# Altium schematic sheet ETH_PCIE_PHY.SchDoc: =project_title
size Tabloid; CompanyName: Luxonis Holding; Organization: Luxonis Holding; Address1: 1925 Harmony Park Drive; Address2: Westminster, CO; Address3: 80234; Address4: United States; SheetNumber: 7; SheetTotal: 12
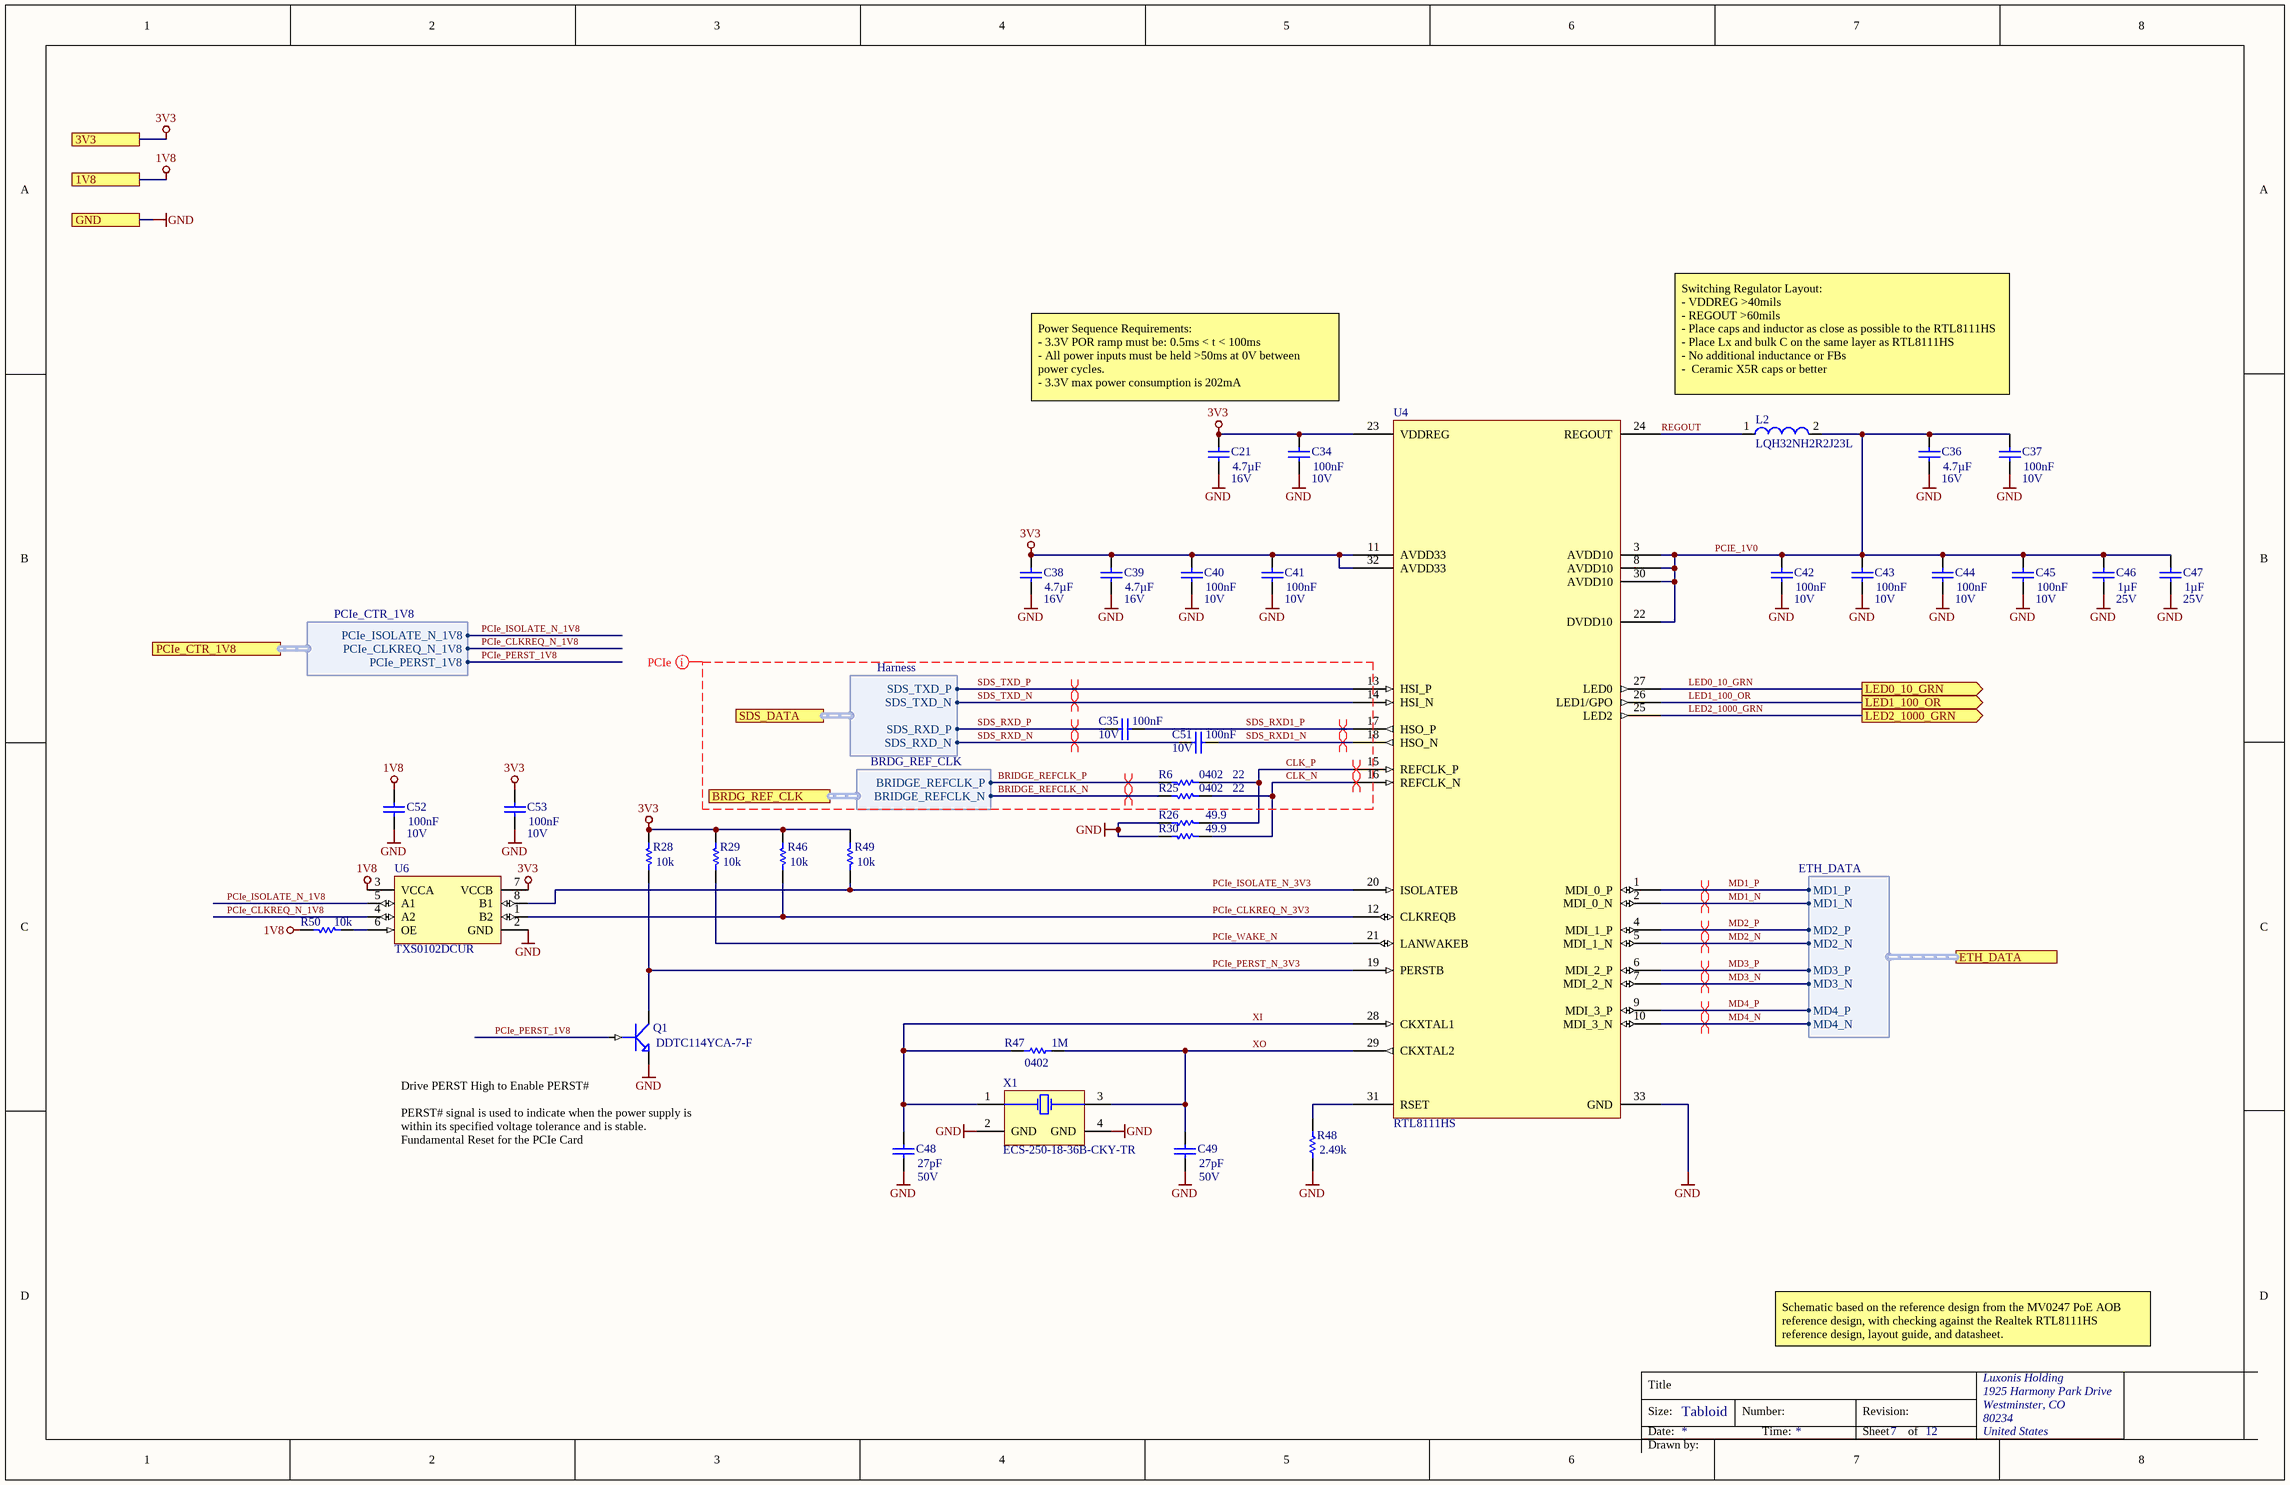
[diagram p0: ETH_PCIE_PHY.SchDoc]

## Parts
C21  value 4.7µF  Voltage Rating: 16V  [CAPC0603(1608)100_N]  (hidden comment: GRM188R61C475KAAJD)
C34  value 100nF  Voltage Rating: 10V  [CAPC0402(1005)70_N]  (hidden comment: GRM155R71A104JA01D)
C35  value 100nF  Voltage Rating: 10V  [CAPC0201(0603)33_L]  (hidden comment: GRM033R61A104KE15D)
C36  value 4.7µF  Voltage Rating: 16V  [CAPC0603(1608)100_N]  (hidden comment: GRM188R61C475KAAJD)
C37  value 100nF  Voltage Rating: 10V  [CAPC0402(1005)70_N]  (hidden comment: GRM155R71A104JA01D)
C38  value 4.7µF  Voltage Rating: 16V  [CAPC0603(1608)100_N]  (hidden comment: GRM188R61C475KAAJD)
C39  value 4.7µF  Voltage Rating: 16V  [CAPC0603(1608)100_N]  (hidden comment: GRM188R61C475KAAJD)
C40  value 100nF  Voltage Rating: 10V  [CAPC0402(1005)70_N]  (hidden comment: GRM155R71A104JA01D)
C41  value 100nF  Voltage Rating: 10V  [CAPC0402(1005)70_N]  (hidden comment: GRM155R71A104JA01D)
C42  value 100nF  Voltage Rating: 10V  [CAPC0402(1005)70_N]  (hidden comment: GRM155R71A104JA01D)
C43  value 100nF  Voltage Rating: 10V  [CAPC0402(1005)70_N]  (hidden comment: GRM155R71A104JA01D)
C44  value 100nF  Voltage Rating: 10V  [CAPC0402(1005)70_N]  (hidden comment: GRM155R71A104JA01D)
C45  value 100nF  Voltage Rating: 10V  [CAPC0402(1005)70_N]  (hidden comment: GRM155R71A104JA01D)
C46  value 1µF  Voltage Rating: 25V  [CAPC0402(1005)70_N]  (hidden comment: GRM155R61E105KA12D)
C47  value 1µF  Voltage Rating: 25V  [CAPC0402(1005)70_N]  (hidden comment: GRM155R61E105KA12D)
C48  value 27pF  Voltage Rating: 50V  [CAPC0402(1005)60_N]  (hidden comment: C0402C270J5GACTU)
C49  value 27pF  Voltage Rating: 50V  [CAPC0402(1005)60_N]  (hidden comment: C0402C270J5GACTU)
C51  value 100nF  Voltage Rating: 10V  [CAPC0201(0603)33_L]  (hidden comment: GRM033R61A104KE15D)
C52  value 100nF  Voltage Rating: 10V  [CAPC0402(1005)70_N]  (hidden comment: GRM155R71A104JA01D)
C53  value 100nF  Voltage Rating: 10V  [CAPC0402(1005)70_N]  (hidden comment: GRM155R71A104JA01D)
L2  LQH32NH2R2J23L  [LQH32NH2R2J23L]
Q1  DDTC114YCA-7-F  [DDTC114YCA-7-F-Footprint-1]
R6  value 22  Case/Package: 0402  [RESC0402(1005)_L]  (hidden comment: RC0402FR-0722RL)
R25  value 22  Case/Package: 0402  [RESC0402(1005)_L]  (hidden comment: RC0402FR-0722RL)
R26  value 49.9  [RESC0402(1005)_L]  (hidden comment: RC0402FR-0749R9L)
R28  value 10k  [RESC0402(1005)_N]  (hidden comment: RC0402FR-1310KL)
R29  value 10k  [RESC0402(1005)_N]  (hidden comment: RC0402FR-1310KL)
R30  value 49.9  [RESC0402(1005)_L]  (hidden comment: RC0402FR-0749R9L)
R46  value 10k  [RESC0402(1005)_N]  (hidden comment: RC0402FR-1310KL)
R47  value 1M  Case/Package: 0402  [RESC0402(1005)_N]  (hidden comment: RC0402FR-071ML)
R48  value 2.49k  [RESC0402(1005)_N]  (hidden comment: RC0402FR-072K49L)
R49  value 10k  [RESC0402(1005)_N]  (hidden comment: RC0402FR-1310KL)
R50  value 10k  [RESC0402(1005)_N]  (hidden comment: RC0402FR-1310KL)
U4  RTL8111HS  [RTL8111Hx-CG]
U6  TXS0102DCUR  [TXS0102DCUR]
X1  ECS-250-18-36B-CKY-TR  [ECS-250-18-36B-CKY-TR]

## Ports
1V8, 3V3, BRDG_REF_CLK (harness BRDG_REF_CLK), ETH_DATA (harness ETH_DATA), GND, LED0_10_GRN (out), LED1_100_OR (out), LED2_1000_GRN (out), PCIe_CTR_1V8 (harness PCIe_CTR_1V8), SDS_DATA (harness Harness)

## Harnesses
ETH_DATA: MD1_P, MD1_N, MD2_P, MD2_N, MD3_P, MD3_N, MD4_P, MD4_N
Harness: SDS_TXD_P, SDS_TXD_N, SDS_RXD_P, SDS_RXD_N
BRDG_REF_CLK: BRIDGE_REFCLK_P, BRIDGE_REFCLK_N
PCIe_CTR_1V8: PCIe_CLKREQ_N_1V8, PCIe_ISOLATE_N_1V8, PCIe_PERST_1V8

## Nets
1V8: C52.2 R50.2 U6.3(VCCA) ; port 1V8
3V3: C21.2 C34.2 C38.2 C39.2 C40.2 C41.2 C53.2 R28.1 R29.1 R46.1 R49.1 U4.11(AVDD33) U4.23(VDDREG) U4.32(AVDD33) U6.7(VCCB) ; port 3V3
GND: C21.1 C34.1 C36.1 C37.1 C38.1 C39.1 C40.1 C41.1 C42.1 C43.1 C44.1 C45.1 C46.1 C47.1 C48.1 C49.1 C52.1 C53.1 Q1.2(E) R26.1 R30.1 R48.1 U4.33(GND) U6.2(GND) X1.2(GND) X1.4(GND) ; port GND
BRIDGE_REFCLK_N: R25.2 ; port BRDG_REF_CLK.BRIDGE_REFCLK_N
BRIDGE_REFCLK_P: R6.2 ; port BRDG_REF_CLK.BRIDGE_REFCLK_P
CLK_N: R25.1 R30.2 U4.16(REFCLK_N)
CLK_P: R6.1 R26.2 U4.15(REFCLK_P)
LED0_10_GRN: U4.27(LED0) ; port LED0_10_GRN
LED1_100_OR: U4.26(LED1/GPO) ; port LED1_100_OR
LED2_1000_GRN: U4.25(LED2) ; port LED2_1000_GRN
MD1_N: U4.2(MDI_0_N) ; port ETH_DATA.MD1_N
MD1_P: U4.1(MDI_0_P) ; port ETH_DATA.MD1_P
MD2_N: U4.5(MDI_1_N) ; port ETH_DATA.MD2_N
MD2_P: U4.4(MDI_1_P) ; port ETH_DATA.MD2_P
MD3_N: U4.7(MDI_2_N) ; port ETH_DATA.MD3_N
MD3_P: U4.6(MDI_2_P) ; port ETH_DATA.MD3_P
MD4_N: U4.10(MDI_3_N) ; port ETH_DATA.MD4_N
MD4_P: U4.9(MDI_3_P) ; port ETH_DATA.MD4_P
PCIE_1V0: C36.2 C37.2 C42.2 C43.2 C44.2 C45.2 C46.2 C47.2 L2.2 U4.3(AVDD10) U4.8(AVDD10) U4.22(DVDD10) U4.30(AVDD10)
PCIe_CLKREQ_N_1V8: U6.4(A2) ; port PCIe_CTR_1V8.PCIe_CLKREQ_N_1V8
PCIe_CLKREQ_N_3V3: R46.2 U4.12(CLKREQB) U6.1(B2)
PCIe_ISOLATE_N_1V8: U6.5(A1) ; port PCIe_CTR_1V8.PCIe_ISOLATE_N_1V8
PCIe_ISOLATE_N_3V3: R49.2 U4.20(ISOLATEB) U6.8(B1)
PCIe_PERST_1V8: Q1.1(B) ; port PCIe_CTR_1V8.PCIe_PERST_1V8
PCIe_PERST_N_3V3: Q1.3(C) R28.2 U4.19(PERSTB)
PCIe_WAKE_N: R29.2 U4.21(LANWAKEB)
REGOUT: L2.1 U4.24(REGOUT)
SDS_RXD1_N: C51.2 U4.18(HSO_N)
SDS_RXD1_P: C35.2 U4.17(HSO_P)
SDS_RXD_N: C51.1 ; port SDS_DATA.SDS_RXD_N
SDS_RXD_P: C35.1 ; port SDS_DATA.SDS_RXD_P
SDS_TXD_N: U4.14(HSI_N) ; port SDS_DATA.SDS_TXD_N
SDS_TXD_P: U4.13(HSI_P) ; port SDS_DATA.SDS_TXD_P
XI: C48.2 R47.1 U4.28(CKXTAL1) X1.1(X1)
XO: C49.2 R47.2 U4.29(CKXTAL2) X1.3(X2)
NetR48_2: R48.2 U4.31(RSET)
NetR50_1: R50.1 U6.6(OE)

## Layout directives
differential pair; net class ETH; differential pair class 100ohm: MD1_N, MD1_P, MD2_N, MD2_P, MD3_N, MD3_P, MD4_N, MD4_P
differential pair; differential pair class 100ohm: BRIDGE_REFCLK_N, BRIDGE_REFCLK_P, CLK_N, CLK_P, SDS_RXD1_N, SDS_RXD1_P, SDS_RXD_N, SDS_RXD_P, SDS_TXD_N, SDS_TXD_P
net class PCIe: BRIDGE_REFCLK_N, BRIDGE_REFCLK_P, CLK_N, CLK_P, SDS_RXD1_N, SDS_RXD1_P, SDS_RXD_N, SDS_RXD_P, SDS_TXD_N, SDS_TXD_P

## Notes on the sheet
- Power Sequence Requirements:
  - 3.3V POR ramp must be: 0.5ms < t < 100ms
  - All power inputs must be held >50ms at 0V between power cycles.
  - 3.3V max power consumption is 202mA
- Switching Regulator Layout:
  - VDDREG >40mils
  - REGOUT >60mils
  - Place caps and inductor as close as possible to the RTL8111HS
  - Place Lx and bulk C on the same layer as RTL8111HS
  - No additional inductance or FBs
  -  Ceramic X5R caps or better
- (near Q1) Drive PERST High to Enable PERST#
- PERST# signal is used to indicate when the power supply is within its specified voltage tolerance and is stable.
  Fundamental Reset for the PCIe Card
- Schematic based on the reference design from the MV0247 PoE AOB reference design, with checking against the Realtek RTL8111HS reference design, layout guide, and datasheet.
- Title
- Size:
- Date:
- Tabloid
- Number:
- Time:
- Revision:
- Sheet
- of
- Drawn by:

## Library data of the parts
C21 C36 C38 C39 = CMP-004-000020-4: CAP CER 4.7UF 16V X5R 0603 10%; Manufacturer 1: Murata; Manufacturer Part Number 1: GRM188R61C475KAAJD; Case/Package: 0603; Min Operating Temperature: -55°C; Max Operating Temperature: 85°C; Tolerance: 10%; Dielectric: X5R; Length: 1.6mm; Height: 0.8mm; Width: 0.8mm; Depth: 0.8mm; ComponentLink1URL: https://datasheet.ciiva.com/14813/595grm188r61c475kaaj23-14813668.pdf?src-supplier=Arrow; ComponentLink1Description: https://datasheet.ciiva.com/14813/595grm188r61c475kaaj23-14813668.pdf?src-supplier=Arrow; Manufacturer 2: Murata; Manufacturer Part Number 2: GRM188R61C475KAAJD; Manufacturer 3: Murata; Manufacturer Part Number 3: GRM188R61C475KAAJD; Design Item ID: GRM188R61C475KAAJD; Mounting Technology: SMT
C34 C37 C40-C45 C52 C53 = CMP-108-000015-5: CAP CER 0.1UF 10V X7R 0402 5%; Manufacturer 1: Murata; Manufacturer Part Number 1: GRM155R71A104JA01D; Case/Package: 0402; Min Operating Temperature: -55°C; Max Operating Temperature: 125°C; Tolerance: 5%; Dielectric: X7R; Length: 1mm; Height: 0.5mm; Width: 0.02inch; Depth: 0.5mm; ComponentLink1URL: https://datasheet.ciiva.com/5411/product-5411135.pdf?src-supplier=Mouser; ComponentLink1Description: https://datasheet.ciiva.com/5411/product-5411135.pdf?src-supplier=Mouser; ComponentLink2URL: https://datasheet.ciiva.com/11618/c02e-11618821.pdf?src-supplier=Avnet; ComponentLink2Description: https://datasheet.ciiva.com/11618/c02e-11618821.pdf?src-supplier=Avnet; Design Item ID: GRM155R71A104JA01D; Mounting Technology: SMT
C35 C51 = CMP-004-000007-6: CAP CER 0.1UF 10V X5R 0201 10%; Manufacturer 1: Murata; Manufacturer Part Number 1: GRM033R61A104KE15D; Case/Package: 0201; Min Operating Temperature: -55°C; Max Operating Temperature: 85°C; Tolerance: 10%; Dielectric: X5R; Length: 0.6mm; Height: 0.3mm; Width: 0.012inch; Depth: 0.3mm; ComponentLink1URL: https://datasheet.ciiva.com/26843/getdatasheetpartid-308656-26843739.pdf?src-supplier=Verical; ComponentLink1Description: https://datasheet.ciiva.com/26843/getdatasheetpartid-308656-26843739.pdf?src-supplier=Verical; ComponentLink2URL: https://datasheet.ciiva.com/5413/product-5413117.pdf?src-supplier=Mouser; ComponentLink2Description: https://datasheet.ciiva.com/5413/product-5413117.pdf?src-supplier=Mouser; ComponentLink3URL: https://datasheet.ciiva.com/6256/partnumbering-e-01-6256406.pdf?src-supplier=Digi-Key; ComponentLink3Description: https://datasheet.ciiva.com/6256/partnumbering-e-01-6256406.pdf?src-supplier=Digi-Key; ComponentLink4URL: https://datasheet.ciiva.com/6256/partnumbering-e-01-6256407.pdf?src-supplier=Digi-Key; ComponentLink4Description: https://datasheet.ciiva.com/6256/partnumbering-e-01-6256407.pdf?src-supplier=Digi-Key; ComponentLink5URL: https://datasheet.ciiva.com/6256/partnumbering-e-01-6256408.pdf?src-supplier=Digi-Key; ComponentLink5Description: https://datasheet.ciiva.com/6256/partnumbering-e-01-6256408.pdf?src-supplier=Digi-Key; Design Item ID: GRM033R61A104KE15D; Mounting Technology: SMT
C46 C47 = CMP-108-000014-5: CAP CER 1UF 25V X5R 0402 10%; Manufacturer 1: Murata; Manufacturer Part Number 1: GRM155R61E105KA12D; Case/Package: 0402; Min Operating Temperature: -55°C; Max Operating Temperature: 85°C; Tolerance: 10%; Dielectric: X5R; Length: 1mm; Height: 0.5mm; Width: 0.5mm; Depth: 0.5mm; ComponentLink1URL: https://datasheet.ciiva.com/22732/1666664-22732122.pdf?src-supplier=Element14; ComponentLink1Description: https://datasheet.ciiva.com/22732/1666664-22732122.pdf?src-supplier=Element14; ComponentLink2URL: https://datasheet.ciiva.com/7719/1666664-7719006.pdf?src-supplier=Element14; ComponentLink2Description: https://datasheet.ciiva.com/7719/1666664-7719006.pdf?src-supplier=Element14; Design Item ID: GRM155R61E105KA12D; Mounting Technology: SMT
C48 C49 = CMP-108-000006-6: CAP CER 27PF 50V C0G 0402 5%; Manufacturer 1: KEMET; Manufacturer Part Number 1: C0402C270J5GACTU; Case/Package: 0402; Min Operating Temperature: -55°C; Max Operating Temperature: 125°C; Tolerance: 5%; Dielectric: C0G; Length: 1mm; Height: 0.5mm; Width: 0.5mm; Depth: 0.5mm; ComponentLink1URL: https://datasheet.ciiva.com/144/docfinderpartnumber-c0402c270j5gactu-144118.pdf?src-supplier=Digi-Key; ComponentLink1Description: https://datasheet.ciiva.com/144/docfinderpartnumber-c0402c270j5gactu-144118.pdf?src-supplier=Digi-Key; ComponentLink2URL: https://datasheet.ciiva.com/7747/kem-c1003-c0g-smd-7747509.pdf?src-supplier=Element14; ComponentLink2Description: https://datasheet.ciiva.com/7747/kem-c1003-c0g-smd-7747509.pdf?src-supplier=Element14; ComponentLink3URL: https://datasheet.ciiva.com/26847/getdatasheetpartid-408632-26847386.pdf?src-supplier=Verical; ComponentLink3Description: https://datasheet.ciiva.com/26847/getdatasheetpartid-408632-26847386.pdf?src-supplier=Verical; ComponentLink4URL: https://datasheet.ciiva.com/7392/1372242-7392237.pdf?src-supplier=Newark; ComponentLink4Description: https://datasheet.ciiva.com/7392/1372242-7392237.pdf?src-supplier=Newark; ComponentLink5URL: https://datasheet.ciiva.com/14586/70095383-14586671.pdf?src-supplier=Allied+Electronics; ComponentLink5Description: https://datasheet.ciiva.com/14586/70095383-14586671.pdf?src-supplier=Allied+Electronics; Design Item ID: C0402C270J5GACTU; Mounting Technology: SMT
L2 = CMP-112-000003-2: FIXED IND 2.2UH 610MA 97MOHM SMD; Manufacturer 1: Murata; Tolerance: 5%; Self Resonant Frequency: 75MHz; Value: 2.2µH; Manufacturer Part Number 1: LQH32NH2R2J23L; Case/Package: Nonstandard; Current Rating: 610mA
Q1 = CMP-074-000000-4: TRANS PREBIAS NPN 200MW SOT23-3; Manufacturer 1: Diodes; Continuous Drain Current: 100mA; Max Drain to Source Voltage: 50V; Manufacturer Part Number 1: DDTC114YCA-7-F; Case/Package: SOT-23-3; Design Item ID: DDTC114YCA-7-F
R6 R25 = CMP-013-000012-8: RES SMD 22 OHM 1% 1/16W 0402; Manufacturer 1: Yageo; Power Rating: 62.5mW; Manufacturer Part Number 1: RC0402FR-0722RL; Min Operating Temperature: -55°C; Max Operating Temperature: 155°C; Tolerance: 1%; Design Item ID: RC0402FR-0722RL
R26 R30 = CMP-115-000016-6: RES SMD 49.9 OHM 1% 1/16W 0402; Manufacturer 1: Yageo; Power Rating: 62.5mW; Temperature Coefficient: 100ppm/°C; Voltage Rating: 50V; Manufacturer Part Number 1: RC0402FR-0749R9L; Case/Package: 0402; Min Operating Temperature: -55°C; Max Operating Temperature: 155°C; Tolerance: 1%; Design Item ID: RC0402FR-0749R9L
R28 R29 R46 R49 R50 = CMP-115-000004-8: RES SMD 10K OHM 1% 1/16W 0402; Manufacturer 1: Yageo; Temperature Coefficient: 100ppm/°C; Power Rating: 62.5mW; Voltage Rating: 50V; Manufacturer Part Number 1: RC0402FR-1310KL; Case/Package: 0402; Min Operating Temperature: -55°C; Max Operating Temperature: 155°C; Tolerance: 1%; Design Item ID: RC0402FR-1310KL
R47 = CMP-013-000005-8: RES SMD 1M OHM 1% 1/16W 0402; Manufacturer 1: Yageo; Power Rating: 63mW; Voltage Rating: 50V; Manufacturer Part Number 1: RC0402FR-071ML; Min Operating Temperature: -55°C; Max Operating Temperature: 155°C; Tolerance: 1%; Design Item ID: RC0402FR-071ML
R48 = CMP-115-000015-6: RES SMD 2.49K OHM 1% 1/16W 0402; Manufacturer 1: Yageo; Temperature Coefficient: 100ppm/°C; Power Rating: 62.5mW; Voltage Rating: 50V; Manufacturer Part Number 1: RC0402FR-072K49L; Case/Package: 0402; Min Operating Temperature: -55°C; Max Operating Temperature: 155°C; Tolerance: 1%; Design Item ID: RC0402FR-072K49L
U4 = CMP-113-000000-3: IC ETHERNET/PCIe PHY Realtek; Manufacturer Part Number 1: RTL8111HS-CG; Manufacturer 1: Realtek
U6 = CMP-113-000005-2: TEXAS INSTRUMENTS - TXS0102DCUR - IC, TRANSLATOR, 2 BIT, BI, US-8; Min Supply Voltage: 1.65V; Max Supply Voltage: 5.5V; Max Output Current: 1A; Manufacturer 1: Texas Instruments; Manufacturer Part Number 1: TXS0102DCUR; Case/Package: VSSOP; Min Operating Temperature: -40°C; Max Operating Temperature: 85°C; Pins: 8
X1 = CMP-006-000002-2: CRYSTAL 25.0000MHZ 18PF SMD 25MHz ±10ppm Crystal 18pF 50 Ohms 4-SMD, No Lead; Manufacturer 1: ECS International; Manufacturer Part Number 1: ECS-250-18-36B-CKY-TR; Frequency: 25MHz